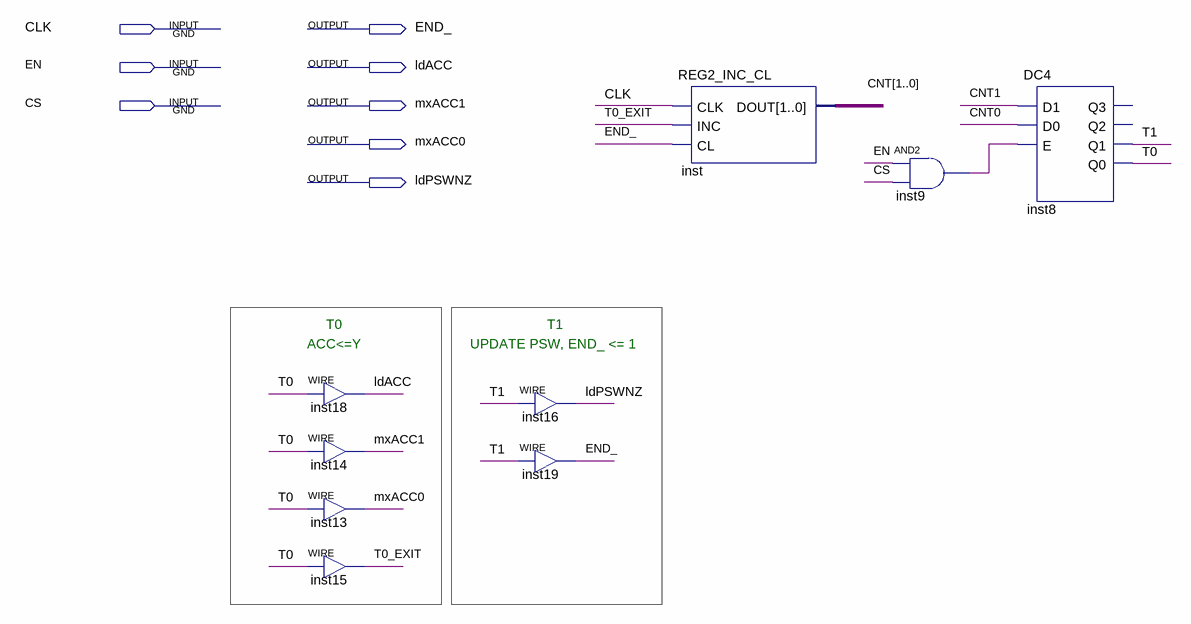
[diagram p0: schematic sheet]
// Quartus schematic TYA.bdf as structural Verilog: 9 symbols, 8 pins
module TYA (
  input  CLK,
  input  EN,
  input  CS,
  output END_,
  output ldACC,
  output mxACC1,
  output mxACC0,
  output ldPSWNZ
);

  wire inst9_out, T0, T0_EXIT, T1;
  wire [1:0] CNT;

  assign ldACC = T0;  // WIRE inst18
  assign mxACC1 = T0;  // WIRE inst14
  assign mxACC0 = T0;  // WIRE inst13
  assign T0_EXIT = T0;  // WIRE inst15
  assign ldPSWNZ = T1;  // WIRE inst16
  assign END_ = T1;  // WIRE inst19
  REG2_INC_CL inst (.CLK(CLK), .INC(T0_EXIT), .CL(END_), .DOUT(CNT));
  and inst9 (inst9_out, EN, CS);
  DC4 inst8 (.D1(CNT[1]), .D0(CNT[0]), .E(inst9_out), .Q1(T1), .Q0(T0));  // open: Q3, Q2

  // Notes on the sheet:
  //   T0
  //   T1
  //   ACC<=Y
  //   UPDATE PSW, END_ <= 1
endmodule
